# Altium schematic sheet PWM Buck SW.SchDoc
size A; SheetNumber: 1; SheetTotal: 1
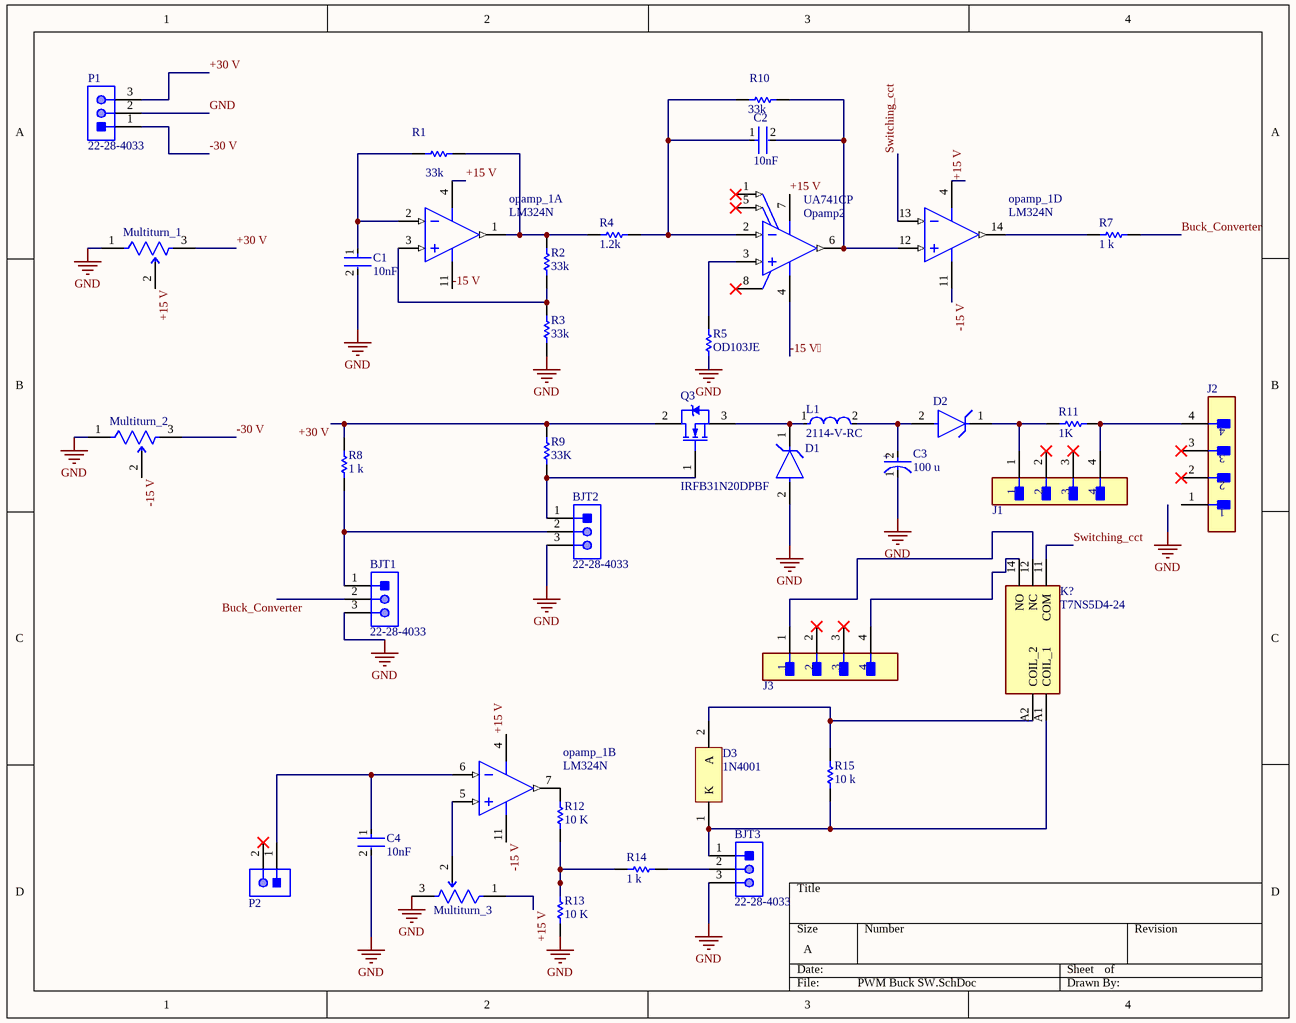
[diagram p0: PWM Buck SW.SchDoc]

## Parts
BJT1  22-28-4033  [MOLX-22-28-4033_V]
BJT2  22-28-4033  [MOLX-22-28-4033_V]
BJT3  22-28-4033  [MOLX-22-28-4033_V]
C1  10nF  [FP-VY1472M63Y5UQ6TV0-MFG]
C2  10nF  [FP-VY1472M63Y5UQ6TV0-MFG]
C3  100 u  [FP-RAD-TH-D_16_0_5-L_25_2-MFG]
C4  10nF  [FP-VY1472M63Y5UQ6TV0-MFG]
D1  (no value)  [FP-6_561-5001_02-4-MFG]
D2  (no value)  [FP-6_561-5001_02-4-MFG]
D3  1N4001  [ONSC-AXIAL_LEAD-2-59-10_P]
J1  (no value)  [FP-47053-3000-MFG]
J2  (no value)  [FP-47053-3000-MFG]
J3  (no value)  [FP-47053-3000-MFG]
K?  T7NS5D4-24  [T7NS5D424]
L1  2114-V-RC  [FP-2114-V-RC-MFG]
Multiturn_1  (no value)  [FP-3296W-MFG]
Multiturn_2  (no value)  [FP-3296W-MFG]
Multiturn_3  (no value)  [FP-3296W-MFG]
Opamp2  UA741CP  [P0008A]
opamp_1  LM324N  [N0014A]  (parts A,B,D of 4)
P1  22-28-4033  [MOLX-22-28-4033_V]
P2  (no value)  [61300211121]
Q3  IRFB31N20DPBF  [INTR-TO-220AB-3]
R1  33k  [OMTE-RES7X2.5-2]
R2  33k  [OMTE-RES7X2.5-2]
R3  33k  [OMTE-RES7X2.5-2]
R4  1.2k  [OMTE-RES7X2.5-2]
R5  OD103JE  [OMTE-RES7X2.5-2]
R7  1 k  [OMTE-RES7X2.5-2]
R8  1 k  [OMTE-RES7X2.5-2]
R9  33K  [RESA90-1450X520]
R10  33k  [OMTE-RES7X2.5-2]
R11  1K  [RESA60-630X240]
R12  10 K  [OMTE-RES7X2.5-2]
R13  10 K  [OMTE-RES7X2.5-2]
R14  1 k  [OMTE-RES7X2.5-2]
R15  10 k  [OMTE-RES7X2.5-2]

## Nets
GND: BJT1.3 BJT2.3 BJT3.3 C1.2 C3.1(C) C4.2 D1.2(A) Multiturn_1.1(CCW) Multiturn_2.1(CCW) Multiturn_3.3(CW) P1.2 R3.2 R5.2 R13.1
+15 V: Multiturn_1.2(WIPER) Multiturn_3.1(CCW) Opamp2.7(VCC+) opamp_1.4(V+)
+30 V: Multiturn_1.3(CW) P1.3 Q3.2(D) R8.2 R9.2
-15 V: Multiturn_2.2(WIPER) Opamp2.4(VCC-) opamp_1.11(GND)
-30 V: Multiturn_2.3(CW) P1.1
Buck_Converter: BJT1.2 R7.2
Switching_cct: K?.11(COM) opamp_1.13(IN4-)
NetBJT1_1: BJT1.1 BJT2.2 R8.1
NetBJT2_1: BJT2.1 Q3.1(G) R9.1
NetBJT3_1: BJT3.1 D3.1(K) K?.A1(COIL_1) R15.1
NetBJT3_2: BJT3.2 R14.2
NetC1_1: C1.1 opamp_1.2(IN1-) R1.2
NetC2_1: C2.1 Opamp2.2(IN-) R4.1 R10.1
NetC2_2: C2.2 Opamp2.6(OUT) opamp_1.12(IN4+) R10.2
NetC3_2: C3.2(A) D2.2(A) L1.2
NetC4_1: C4.1 opamp_1.6(IN2-) P2.1
NetD1_1: D1.1(C) L1.1 Q3.3(S)
NetD2_1: D2.1(C) J1.1 R11.1
NetD3_2: D3.2(A) K?.A2(COIL_2) R15.2
NetJ1_4: J1.4 J2.4 R11.2
NetJ3_1: J3.1 K?.12(NC)
NetJ3_4: J3.4 K?.14(NO)
NetMultiturn_3_2: Multiturn_3.2(WIPER) opamp_1.5(IN2+)
NetOpamp2_3: Opamp2.3(IN+) R5.1
Netopamp_1_1: opamp_1.1(OUT1) R1.1 R2.1 R4.2
Netopamp_1_3: opamp_1.3(IN1+) R2.2 R3.1
Netopamp_1_7: opamp_1.7(OUT2) R12.2
Netopamp_1_14: opamp_1.14(OUT4) R7.1
NetR12_1: R12.1 R13.2 R14.1

Not connected (* = marked no-connect by the designer): J1 2* 3*; J2 1 2* 3*; J3 2* 3*; Opamp2 1(OFFSET_N1)* 5(OFFSET_N2)* 8(NC)*; P2 2*

## Notes on the sheet
- Labels drawn without touching a wire or pin: 
- (in symbol CMP-05427-000487-1) +

## Library data of the parts
BJT1-BJT3 P1 = CMP-1676-00001-5: Male Header, Pitch 2.54 mm, 1 x 3 Position, Height 8.38 mm, Tail Length 3.18 mm, RoHS, Bulk; Manufacturer: Molex; Rows: 1; Voltage Rating: 250 V; Current Rating: 4 A; Min Operating Temperature: 0 degC; Lead Pitch: 0.1 inch; Packaging: Bulk; Contact Finish: Gold; RoHSCompliant: true; Contact Material: Brass; PackageReference: 22-28-4033; REACH SVHC: Unknown; PackageDescription: Male Header, Pitch 2.54 mm, 1 x 3 Position, Height 8.38 mm, Tail Length 3.18 mm; ComponentLink2URL: http://www.molex.com/pdm_docs/sd/022284033_sd.pdf; Height: 8.38 mm; Mounting Technology: Through Hole; ComponentLink1Description: Manufacturer URL; Length: 7.62 mm; Mount: Through Hole; DatasheetVersion: Rev. G, 01/2012; Max Operating Temperature: 75 degC; ComponentLink2Description: Datasheet; Colour: Black; Pins: 3; Contact Plating: Gold; Package Quantity: 1; ComponentLink1URL: http://www.molex.com/
C1 C2 C4 = CMP-02417-000050-1: CAP CER 4700PF 760VAC Y5U RADIAL; Voltage Rating (AC): 500V; Lead Diameter: 0.6mm; Capacitance: 4.7nF; Tolerance: 20%; Lead/Base Style: Kinked; Termination: Radial; Resistor Type: Ceramic; Radiation Hardening: No; Diameter: 16mm; Max Operating Temperature: 125°C; Case/Package: Radial; Thickness: 5mm; Lead Pitch: 10mm; Series: VY1; Contact Plating: Tin; Depth: 5mm; RoHS Compliant: Yes; Voltage: 500V; Voltage Rating (DC): 500V; Package Quantity: 500; Construction: RADIAL; Min Operating Temperature: -40°C; Height: 19mm; Height - Seated (Max): 0.787inch; Packaging: Tape and Reel; Dielectric: Y5U; Mount: Through Hole
C3 = CMP-05427-000487-1: Aluminum Electrolytic Capacitors (Radial Lead Type) 1000uF ±20% 50V; Ripple Current: 3.32A; Impedance: 16mR; Polarity: Polar; Life (Hours): 10000Hour; Capacitance: 1mF; Lead Diameter: 0.8mm; Mount: Through Hole; Series: FR; Package Quantity: 250; Length: 25mm; Radiation Hardening: No; REACH SVHC: No SVHC; Case/Package: Radial; Height: 25mm; Min Operating Temperature: -40°C; Contact Plating: Tin; Lead Free: Lead Free; Height - Seated (Max): 0.984inch; RoHS Compliant: Yes; Features: General Purpose; ESR (Equivalent Series Resistance): 16mR; Voltage Rating: 50V; Diameter: 16mm; Voltage Rating (DC): 50V; Max Operating Temperature: 105°C; Lead Pitch: 7.5mm; Packaging: Tape and Reel; Number of Pins: 2; Tolerance: 20%; Termination: Through Hole
D1 D2 = CMP-02541-000001-1: DIODE ZENER 15V 1.3W DO41; Manufacturer: Vishay; Manufacturer Part Number: BZX85C15-TAP; Max Reverse Leakage Current: 0.5uA; Reverse Voltage: 11V; Max Zener Voltage: 15.6V; Zener Impedance: 15Ω; Max Junction Temp: +175°C; Power Dissipation: 1300mW; Automotive Grade: Grade 0; Device Class L3: Zener Diodes; Device Class L1: Discrete Semiconductors; Automotive: Yes; Mouser Description: Zener Diodes 15 Volt 1.3 Watt 5%; Lead Free: Yes; Height: 2.6mm; Octopart: https://octopart.com/bzx85c15-tap-vishay-55401762; Temperature: to +175°C; Digikey Description: DIODE ZENER 15V 1.3W DO41; ComponentLink2URL: http://www.vishay.com/docs/85607/bzx85.pdf; Device Class L2: Diodes; RoHS: TRUE; Temperature Range High: +175°C; ComponentLink2Description: Datasheet; Package: 6.561-5001.02-4; Category: Diode; Nom Zener Voltage: 15V
D3 = CMP-0902-00204-1: Standard Recovery Rectifier, 2-Pin Axial_Lead, Pb-Free, Tape and Reel; PartNumber: 1N4001RLG; Manufacturer: On Semiconductor; IO(rec) Max (A): 1; VRRM Max (V): 50; IFSM Max (A): 30; ComponentLink2URL: http://www.onsemi.com/pub_link/Collateral/1N4001-D.PDF; PackageReference: AXIAL_LEAD-2-59-10; PackageDescription: 2-Pin, Axial Lead, Diameter 2.35 mm; ComponentLink3Description: Package Specification; Packing: Tape and Reel; ComponentLink2Description: Datasheet; Type: Standard Recovery; DatasheetVersion: Rev. 13; RoHS: TRUE; ComponentLink3URL: http://www.onsemi.cn/pub_link/Collateral/59-10.PDF; PackageVersion: Rev. U, 02/2005; ComponentLink1Description: Manufacturer URL; Mounting Technology: Through Hole; ComponentLink1URL: http://www.onsemi.com/
J1-J3 = CMP-04776-000447-1: CONN HEADER VERT 4POS 2.54MM; Glow Wire Compliant: Non-compliant; Voltage Rating: 250V; Current Rating: 4A; Number of Circuits: 4; Gender: Male; Orientation: Straight; Packaging: Bulk; Series: 47053; RoHS Compliant: Yes; Termination: Through Hole; Contact Plating: Tin; Mount: Through Hole; Number of Rows: 1; Pitch: 2.54mm; Halogen Free: Low Halogen; Number of Contacts: 4; Min Operating Temperature: 0°C; Package Quantity: 12000; Contact Material: Copper Alloy; Max Operating Temperature: 75°C; REACH SVHC: No SVHC; Number of Positions: 4
K? = T7NS5D4-24: Relay or Contactor; Manufacturer_Name: TE Connectivity; Datasheet Link: https://componentsearchengine.com/Datasheets/2/T7NS5D4-24.pdf; Height: 16.9mm; Manufacturer_Part_Number: T7NS5D4-24
L1 = CMP-07248-000012-1: FIXED IND 150UH 3.4A 62 MOHM TH; Manufacturer: Bourns; Tolerance: 15%; Test Frequency: 1kHz; Shielding: true; Series Resistance: 0.062Ω; Temperature: -55°C to +105°C; Category: Ind; Height: 0.86inch; Device Class L3: Fixed Inductors; Digikey Description: FIXED IND 150UH 3.4A 62 MOHM TH; Device Class L2: Inductors; Composition: Wirewound; Device Class L1: Passive Components; Package: 2114-V-RC; Inductance: 150uH; Temperature Range High: +105°C; ComponentLink2URL: https://www.bourns.com/docs/Product-Datasheets/2100_series.pdf; Manufacturer Part Number: 2114-V-RC; Value: 150uH; RoHS: TRUE; Automotive: No; Octopart: https://octopart.com/2114-v-rc-bourns-39574085; Mouser Description: Fixed Inductors 150uH 15% Vertical; Temperature Range Low: -55°C; ComponentLink2Description: Datasheet; Lead Free: Yes; Rms Current: 3.4A
Multiturn_1-Multiturn_3 = CMP-07234-000043-1: TRIMMER 50K OHM 0.5W PC PIN TOP; Manufacturer Series: 3296; Resistance Tolerance: 10%; Actuator Orientation: Vertical; Resistance: 50kR; Number of Turns: 25; Power Rating: 500mW; Insulation Resistance: 1GR; Actuator Type: SCREW; Resistance Law: Linear; Number of Terminals/Pins: 3; Temperature Coefficient: 100ppm/°C; Weight: 0.03oz; Length: 9.53mm; Package Quantity: 50; Resistor Type: Cermet; Min Operating Temperature: -55°C; Termination: Pin; Radiation Hardening: No; Terminal Finish: Tin; Height: 0.395inch; Depth: 4.83mm; REACH SVHC: No SVHC; Width: 9.53mm; Packaging: Rail/Tube; RoHS Compliant: Yes; Mount: Panel; Max Power Dissipation: 500mW; Taper: Linear; Color: Blue; Technology: CERMET; Lead Free: Lead Free; Max Operating Temperature: 125°C; Number of Pins: 3; Type: Potentiometer; Military Standard: Not; Contact Plating: Tin; Series: 3296; Tolerance: 10%
Opamp2 = CMP-0017-00973-2: General-Purpose Operational Amplifier, 7 to 36 V, 0 to 70 degC, 8-pin DIP (P8), Pb-Free (RoHS); Manufacturer: Texas Instruments; Iq per channel(Max)(mA): 2.8; Number of Channels: 1; Total Supply Voltage(Min)(+5V is 5, +/-5V is 10): 7; IIB(Max)(pA): 800000; Slew Rate(Typ)(V/us): 0.5; Total Supply Voltage(Max)(+5V is 5, +/-5V is 10): 36; Vio (25C)(Max)(mV): 6; CMRR(Min)(dB): 70; Sub Family: General Purpose Amplifier, High Supply Voltage Amplifier (>=30V); PackageVersion: 4040082/E, 04/2010; PackageReference: P0008A; ComponentLink1URL: http://www.ti.com/; Mounting Technology: Through Hole; ComponentLink1Description: Manufacturer URL; GBW(Typ)(MHz): 1; ComponentLink2Description: Datasheet; ComponentLink2URL: http://www.ti.com/lit/ds/symlink/ua741.pdf; PartNumber: UA741CP; Code_JEDEC: MS-001; ComponentLink3Description: Package Specification; DatasheetVersion: SLOS094B; ComponentLink3URL: http://www.ti.com/litv/pdf/mpdi001b; PackageDescription: 8-Pin Plastic In-Line, Body 9.59 x 6.35 mm, Pitch 2.54 mm; Eco-Plan: Pb-Free (RoHS)
opamp_1 = CMP-0055-00082-3: Low Power Quad Operational Amplifier, 14-pin MDIP; Manufacturer: Texas Instruments; CompType: Amplifiers; PowerWise: N; PackageTopMarking: NSUZXYYTTE#*LM324N; PackageDescription: MDIP, .750 x .250 x.130in, 14 Lead, .100in Pitch; Package Reference: N0014A; RoHS: N; Code_JEDEC: MS-001-AA; ComponentLink1URL: http://www.ti.com/general/docs/lit/getliterature.tsp?genericPartNumber=LM324&fileType=pdf; ComponentLink1Description: Datasheet URL; PinCount: 14
P2 = CMP-1712-00002-4: THT Vertical Pin Header WR-PHD, Pitch 2.54 mm, Single Row, 2 pins; Manufacturer: Wurth Elektronik; Rated Current: 3A; Gender: Male; Withstanding Voltage: 500VAC; Working Voltage: 250VAC; Pitch: 2.54mm; Contact Resistance: 20mOhm; Pin Number: 2; Mounting Technology: THT; Orientation: Vertical; Operating Temperature: -40to105degC; Packaging: Bag; Publisher: WurthElektronik; Datasheet URL: https://katalog.we-online.de/em/datasheet/6130xx11121.pdf; Manufacturer URL: http://www.we-online.de; Row Number: Single; Package Reference: 61300211121; Part Number: 61300211121
Q3 = CMP-2000-06468-1: HEXFET(R) Power MOSFET, 200 V, 31 A, 82 mOhm, -55 to 175 degC, 3-Pin FM (TO-220AB), RoHS, Tube; Manufacturer: International Rectifier; Temperature, Operating, Maximum: +175°C; Channel Mode: Enhancement; Power Dissipation: 200W; Time, Turn-Off Delay: 26ns; Voltage, Gate to Source: ±30V; Capacitance, Input: 2370pF@25V; Gate Charge, Total: 70nC; Brand/Series: HEXFET®Series; Voltage, Diode Forward: 1.3V; Polarization: N-Channel; Transconductance, Forward: 17S; Resistance, Thermal, Junction to Case: 0.75°C/W; Current, Drain: 31A; Time, Turn-On Delay: 16ns; Configuration: DualDrain; Resistance, Drain to Source On: 0.082Ω; Channel Type: N; Temperature, Operating, Minimum: -55°C; Number of Elements per Chip: 1; Temperature, Operating, Range: -55to+175°C; Voltage, Drain to Source: 200V; Typical Gate Charge @ Vgs: 70nC@10V; Package Description: 3-Pin Flange Mount, Body 4.445 x 10.415 mm, Pitch 2.54 mm; Length: 10.54mm; Mounting Technology: ThroughHole; Height: 8.77mm; Width: 4.69mm; Datasheet Version: 01/2004; Mounting Type: ThroughHole; Voltage, Forward, Diode: 1.3V; Datasheet URL: http://www.infineon.com/dgdl/irfb31n20dpbf.pdf?fileId=5546d462533600a40153561547951df1; Package Type: TO-220AB; Number of Pins: 3; Package Reference: TO-220AB; Dimensions: 10.54x4.69x8.77mm; Manufacturer URL: http://internationalrectifier.com/; Voltage, Breakdown, Drain to Source: 200V
R1-R4 R7 R8 R10 R12-R15 = CMP-2000-06865-1: Little Demon(R) Carbon Composition Molded OD Series, 250 V, 10 KOhm, +/-5%, -70 to 130 degC, 2-Pin THD, RoHS, Bulk; PartNumber: OD103JE; Manufacturer: Ohmite; Resistance (Ohms): 10k; Power Rating: 0.25W; Power (Watts): 0.25W,1/4W; Tolerance: ±5%; Online Catalog: OD,OF,OASeries,LittleDemon®; Catalog Drawings: OD,OF,OASeries; EDA / CAD Models: DownloadfromAcceleratedDesigns; Mounting Technology: ThroughHole; Datasheet Version: 06/2016; RoHS Information: LittleDemon"E"SeriesMaterialDeclaration; Number of Terminations: 2; Temperature Coefficient: -; Height: -; Composition: CarbonComposition; Package Description: 2-Pin THD Resistor, Body 7 x 2.5 mm, Lead Dia. 0.6 mm; Size / Dimension: 0.098"Diax0.276"L(2.50mmx7.00mm); Category: Resistors; Manufacturer URL: http://www.ohmite.com/; Features: PulseWithstanding; Family: ThroughHoleResistors; Supplier Device Package: Axial; Package / Case: Axial; Standard Package: 100; Package Reference: RES7X2.5; Operating Temperature: -; Series: LittleDemon®OD; Datasheet URL: http://www.ohmite.com/cat/res_od_of_oa.pdf; Packaging: Bulk
R5 = CMP-2000-06865-1: Little Demon(R) Carbon Composition Molded OD Series, 250 V, 10 KOhm, +/-5%, -70 to 130 degC, 2-Pin THD, RoHS, Bulk; Manufacturer: Ohmite; Resistance (Ohms): 10k; Power Rating: 0.25W; Power (Watts): 0.25W,1/4W; Tolerance: ±5%; Online Catalog: OD,OF,OASeries,LittleDemon®; Catalog Drawings: OD,OF,OASeries; EDA / CAD Models: DownloadfromAcceleratedDesigns; Mounting Technology: ThroughHole; Datasheet Version: 06/2016; RoHS Information: LittleDemon"E"SeriesMaterialDeclaration; Number of Terminations: 2; Temperature Coefficient: -; Height: -; Composition: CarbonComposition; Package Description: 2-Pin THD Resistor, Body 7 x 2.5 mm, Lead Dia. 0.6 mm; Size / Dimension: 0.098"Diax0.276"L(2.50mmx7.00mm); Category: Resistors; Manufacturer URL: http://www.ohmite.com/; Features: PulseWithstanding; Family: ThroughHoleResistors; PartNumber: OD103JE; Supplier Device Package: Axial; Package / Case: Axial; Standard Package: 100; Package Reference: RES7X2.5; Operating Temperature: -; Series: LittleDemon®OD; Datasheet URL: http://www.ohmite.com/cat/res_od_of_oa.pdf; Packaging: Bulk
R9 = CMP-1678-00001-6: Axial Resistor, 25 mOhm, +/- 1%, 3 W, -55 to 275 degC, 2-Pin THD, RoHS, Bulk; Manufacturer: Ohmite; Voltage Rating: 100 mV; Min Operating Temperature: -55 degC; Length: 14.5 mm; Pins: 2; ComponentLink1URL: http://www.ohmite.com/; Packaging: Bulk; Mount: Through Hole; DatasheetVersion: 06/2015; RoHSCompliant: true; Mounting Technology: Through Hole; REACH SVHC: Unknown; ComponentLink2Description: Datasheet; PackageReference: Axial Resistor; PackageDescription: 2-Pin Axial Lead, Dia 5.2 mm, Body Length 14.5 mm; ComponentLink2URL: http://www.ohmite.com/cat/res_10.pdf; ComponentLink1Description: Manufacturer URL; Package Quantity: 10; Max Operating Temperature: 275 degC
R11 = CMP-1659-00073-1: Axial Resistor, 100 KOhm, +/- 1%, 0.25 W, -55 to 155 degC, 2-Pin THD, RoHS, Bulk; Voltage Rating: 250 V; Power Rating: 250 mW; Resistance: 475 Ohm; PackageDescription: 2-Pin Axial Lead, Dia 2.4 mm, Body Length 6.3 mm; PackageReference: MFR-25; Length: 0.248 inch; ComponentLink2Description: Datasheet; Packaging: Bulk; DatasheetVersion: Apr-13; Package Quantity: 200; Min Operating Temperature: -55 degC; ComponentLink2URL: http://www.yageo.com/documents/recent/Yageo%20LR_MFR_2013.pdf; RoHSCompliant: true; ComponentLink1URL: http://www.yageo.com/; Tolerance: 1%; Case\Package: Axial; Mount: Through Hole; ComponentLink1Description: Manufacturer URL; Max Operating Temperature: 155 degC